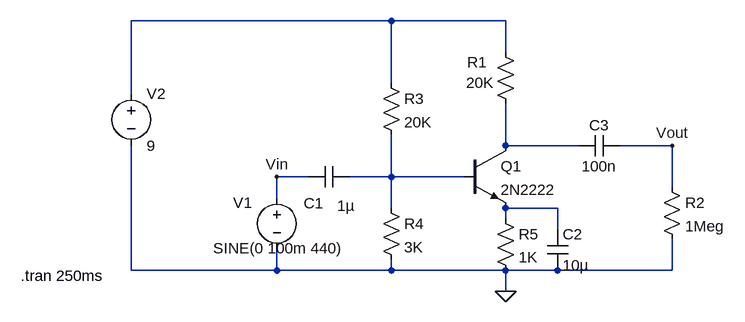
[diagram p0: schematic DRAFT2.asc]
DRAFT2.asc, the LTspice schematic file:
Version 4
SHEET 1 880 680
WIRE 64 -160 -336 -160
WIRE 240 -160 64 -160
WIRE 240 -112 240 -160
WIRE 64 -64 64 -160
WIRE -336 -48 -336 -160
WIRE 240 32 240 -32
WIRE 352 32 240 32
WIRE 496 32 416 32
WIRE -64 80 -112 80
WIRE 64 80 64 16
WIRE 64 80 0 80
WIRE 176 80 64 80
WIRE 496 96 496 32
WIRE -112 112 -112 80
WIRE 64 128 64 80
WIRE 320 128 240 128
WIRE 240 144 240 128
WIRE 320 160 320 128
WIRE -336 224 -336 32
WIRE -112 224 -112 192
WIRE -112 224 -336 224
WIRE 64 224 64 208
WIRE 64 224 -112 224
WIRE 240 224 64 224
WIRE 320 224 240 224
WIRE 496 224 496 176
WIRE 496 224 320 224
WIRE 240 256 240 224
FLAG 240 256 0
FLAG -112 80 Vin
FLAG 496 32 Vout
SYMBOL voltage -112 96 R0
WINDOW 0 -67 24 Left 2
WINDOW 3 -98 94 Left 2
WINDOW 123 0 0 Left 0
WINDOW 39 0 0 Left 0
SYMATTR InstName V1
SYMATTR Value SINE(0 100m 440)
SYMBOL cap 0 64 R90
WINDOW 0 72 55 VBottom 2
WINDOW 3 45 6 VTop 2
SYMATTR InstName C1
SYMATTR Value 1µ
SYMBOL npn 176 32 R0
SYMATTR InstName Q1
SYMATTR Value 2N2222
SYMBOL res 224 -128 R0
WINDOW 0 -43 32 Left 2
WINDOW 3 -45 63 Left 2
SYMATTR InstName R1
SYMATTR Value 20K
SYMBOL voltage -336 -64 R0
WINDOW 123 0 0 Left 0
WINDOW 39 0 0 Left 0
SYMATTR InstName V2
SYMATTR Value 9
SYMBOL res 480 80 R0
SYMATTR InstName R2
SYMATTR Value 1Meg
SYMBOL res 48 -80 R0
SYMATTR InstName R3
SYMATTR Value 20K
SYMBOL res 48 112 R0
SYMATTR InstName R4
SYMATTR Value 3K
SYMBOL res 224 128 R0
SYMATTR InstName R5
SYMATTR Value 1K
SYMBOL cap 304 160 R0
SYMATTR InstName C2
SYMATTR Value 10µ
SYMBOL cap 416 16 R90
WINDOW 0 0 32 VBottom 2
WINDOW 3 32 32 VTop 2
SYMATTR InstName C3
SYMATTR Value 100n
TEXT -506 232 Left 2 !.tran 250ms

The netlist it stands for:
* DRAFT2.asc
V1 Vin 0 SINE(0 100m 440)
C1 N003 Vin 1µ
Q1 N002 N003 N004 0 2N2222
R1 N001 N002 20K
V2 N001 0 9
R2 Vout 0 1Meg
R3 N001 N003 20K
R4 N003 0 3K
R5 N004 0 1K
C2 N004 0 10µ
C3 Vout N002 100n
.model NPN NPN
.model PNP PNP
.lib standard.bjt
.tran 250ms
.backanno
.end